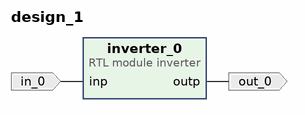
[diagram p0: block diagram of the top level]
# Vivado block design design_1, xc7z020clg400-1, Vivado 2019.1
create_bd_design design_1

create_bd_port -dir I in_0
create_bd_port -dir O out_0

create_bd_cell -type module -reference inverter inverter_0

# ---- connections ----

connect_bd_net -net inverter_0_out [get_bd_pins inverter_0/outp] [get_bd_ports out_0]
connect_bd_net -net in_0_1 [get_bd_ports in_0] [get_bd_pins inverter_0/inp]

validate_bd_design
save_bd_design
